# EAGLE design RFM69W (EAGLE 7.2.0)
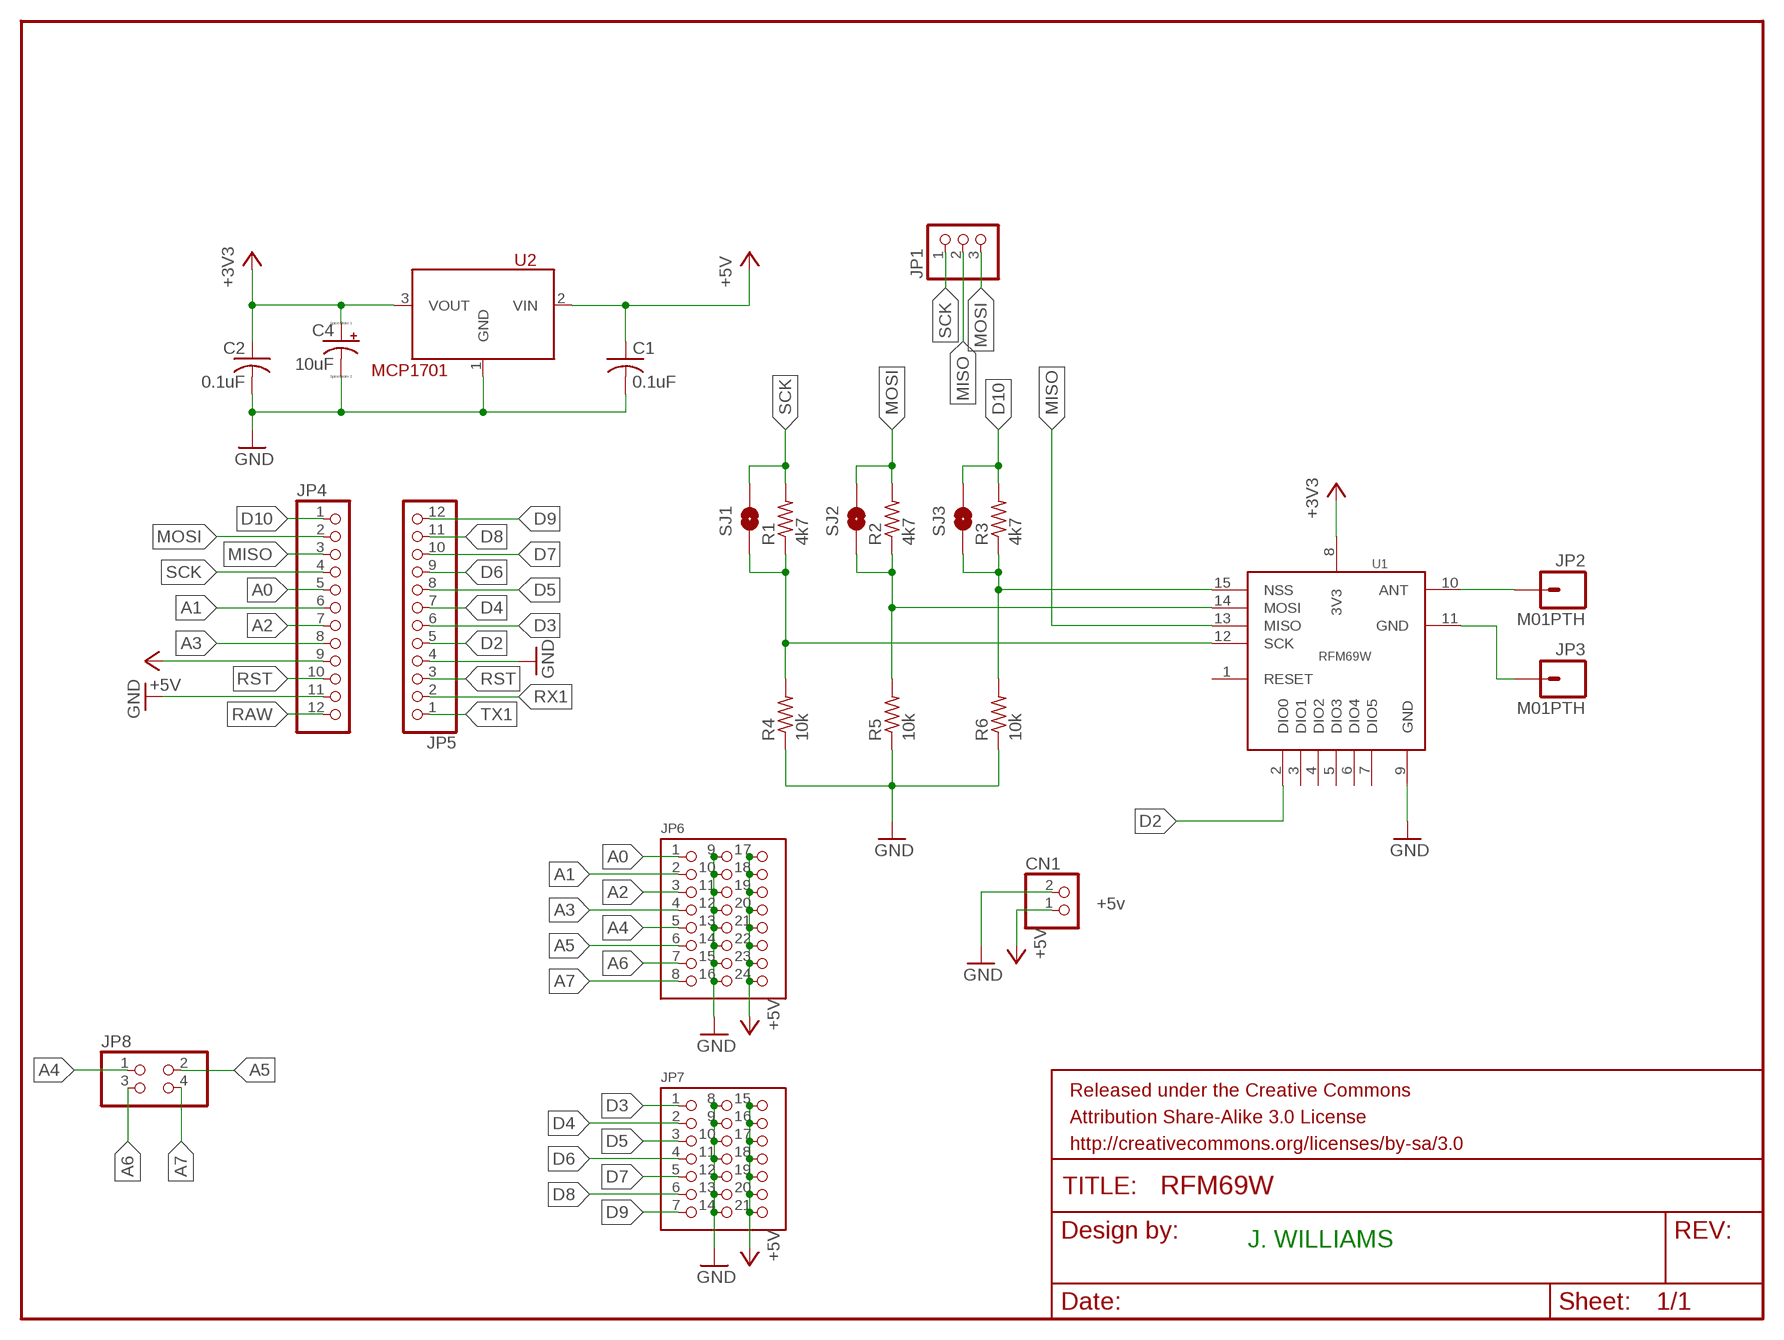
[diagram p0: schematic, sheet 1]

## Parts
C1  0.1uF  C-USC1206  [C1206]
C2  0.1uF  C-USC1206  [C1206]
C4  10uF  CPOL-USA/3216-18R  [A/3216-18R]
CN1  +5v  JST_2PIN-THM-RA  [JST-PH-2-THM-RA]
FRAME1  FRAME-LETTER  [CREATIVE_COMMONS]
JP1  PINHD-1X3  [1X03]
JP2  M01PTH  [1X01]
JP3  M01PTH  [1X01]
JP4  PINHD-1X12  [1X12]
JP5  PINHD-1X12  [1X12]
JP6  PIN_3X8  [PIN_3X8]
JP7  PIN_3X7  [PIN_3X7]
JP8  PINHD-2X2  [2X02]
R1  4k7  R-US_R1206  [R1206]
R2  4k7  R-US_R1206  [R1206]
R3  4k7  R-US_R1206  [R1206]
R4  10k  R-US_R1206  [R1206]
R5  10k  R-US_R1206  [R1206]
R6  10k  R-US_R1206  [R1206]
SJ1  SOLDERJUMPERNO  [SJ_2S-NO]
SJ2  SOLDERJUMPERNO  [SJ_2S-NO]
SJ3  SOLDERJUMPERNO  [SJ_2S-NO]
U1  RFM69W  [RFM69W]
U2  MCP1701  [SOT-89]

## Nets
+3V3: C2.1 C4.+ U1.8(3V3) U2.3(VOUT)
+5V: C1.1 CN1.1 JP4.9 JP6.17 JP6.18 JP6.19 JP6.20 JP6.21 JP6.22 JP6.23 JP6.24 JP7.15 JP7.16 JP7.17 JP7.18 JP7.19 JP7.20 JP7.21 U2.2(VIN)
A0: JP4.5 JP6.1
A1: JP4.6 JP6.2
A2: JP4.7 JP6.3
A3: JP4.8 JP6.4
A4: JP6.5 JP8.1
A5: JP6.6 JP8.2
A6: JP6.7 JP8.3
A7: JP6.8 JP8.4
D2: JP5.5 U1.2(DIO0)
D3: JP5.6 JP7.1
D4: JP5.7 JP7.2
D5: JP5.8 JP7.3
D6: JP5.9 JP7.4
D7: JP5.10 JP7.5
D8: JP5.11 JP7.6
D9: JP5.12 JP7.7
D10: JP4.1 R3.2 SJ3.2
GND: C1.2 C2.2 C4.- CN1.2 JP4.11 JP5.4 JP6.9 JP6.10 JP6.11 JP6.12 JP6.13 JP6.14 JP6.15 JP6.16 JP7.8 JP7.9 JP7.10 JP7.11 JP7.12 JP7.13 JP7.14 R4.1 R5.1 R6.1 U1.9(GND) U2.1(GND)
MISO: JP1.2 JP4.3 U1.13(MISO)
MOSI: JP1.3 JP4.2 R2.2 SJ2.2
N$1: R3.1 R6.2 SJ3.1 U1.15(NSS)
N$5: R2.1 R5.2 SJ2.1 U1.14(MOSI)
N$10: R1.1 R4.2 SJ1.1 U1.12(SCK)
N$11: JP2.1 U1.10(ANT)
N$12: JP3.1 U1.11(GND)
RAW: JP4.12
RST: JP4.10 JP5.3
RX1: JP5.2
SCK: JP1.1 JP4.4 R1.2 SJ1.2
TX1: JP5.1
Unconnected: U1.1(RESET) U1.3(DIO1) U1.4(DIO2) U1.5(DIO3) U1.6(DIO4) U1.7(DIO5)

## Notes on the sheet
- J. WILLIAMS

## Library data of the parts
C1 C2 = rcl:C-US: CAPACITOR, American symbol
C4 = resistor:CPOL-US: POLARIZED CAPACITOR, American symbol
CN1 = adafruit:JST_2PIN: JST 2-Pin Connectors of various flavors SMT-RA (S2B-PH-SM4) 4UConnector #17311 SMT (B2B-PH-SM4) THM-RA (S2B-PH) THM (B2B-PH)
FRAME1 = SparkFun-Aesthetics:FRAME-LETTER: Schematic Frame Standard 8.5x11 US Letter frame
JP1 = pinhead:PINHD-1X3: PIN HEADER
JP2 JP3 = SparkFun-Connectors:M01: Header 1 Standard 1-pin 0.1" header. Use with straight break away headers (SKU : PRT-00116), right angle break away headers (PRT-00553), swiss pins (PRT-00743), machine pins (PRT-00117), and female headers (PRT-00115).
JP4 JP5 = pinhead:PINHD-1X12: PIN HEADER
JP6 = pinhead_3row:PIN_3X8
JP7 = pinhead_3row:PIN_3X7
JP8 = pinhead:PINHD-2X2: PIN HEADER
R1-R6 = resistor:R-US_: RESISTOR, American symbol
SJ1-SJ3 = SparkFun-Passives:SOLDERJUMPER: Solder Jumper Standard SMD solder jumper. Used to automate production. Two varients : Normally Open and Normally Closed are the same, but have different paste layers. NC will have a large amount of paste and should jumper during reflow.
U1 = ChipsParts:RFM69W: Radio Transceiver Module, FSK, 433, 848, 915 MHz, SPI controlled, Mfr=HopeRF
U2 = ChipsParts:MCP1701: Voltage Regulator, LDO, fixed 1.8,2.5,3.0,3.3,5.0V, 500mW/Vdrop

## Board
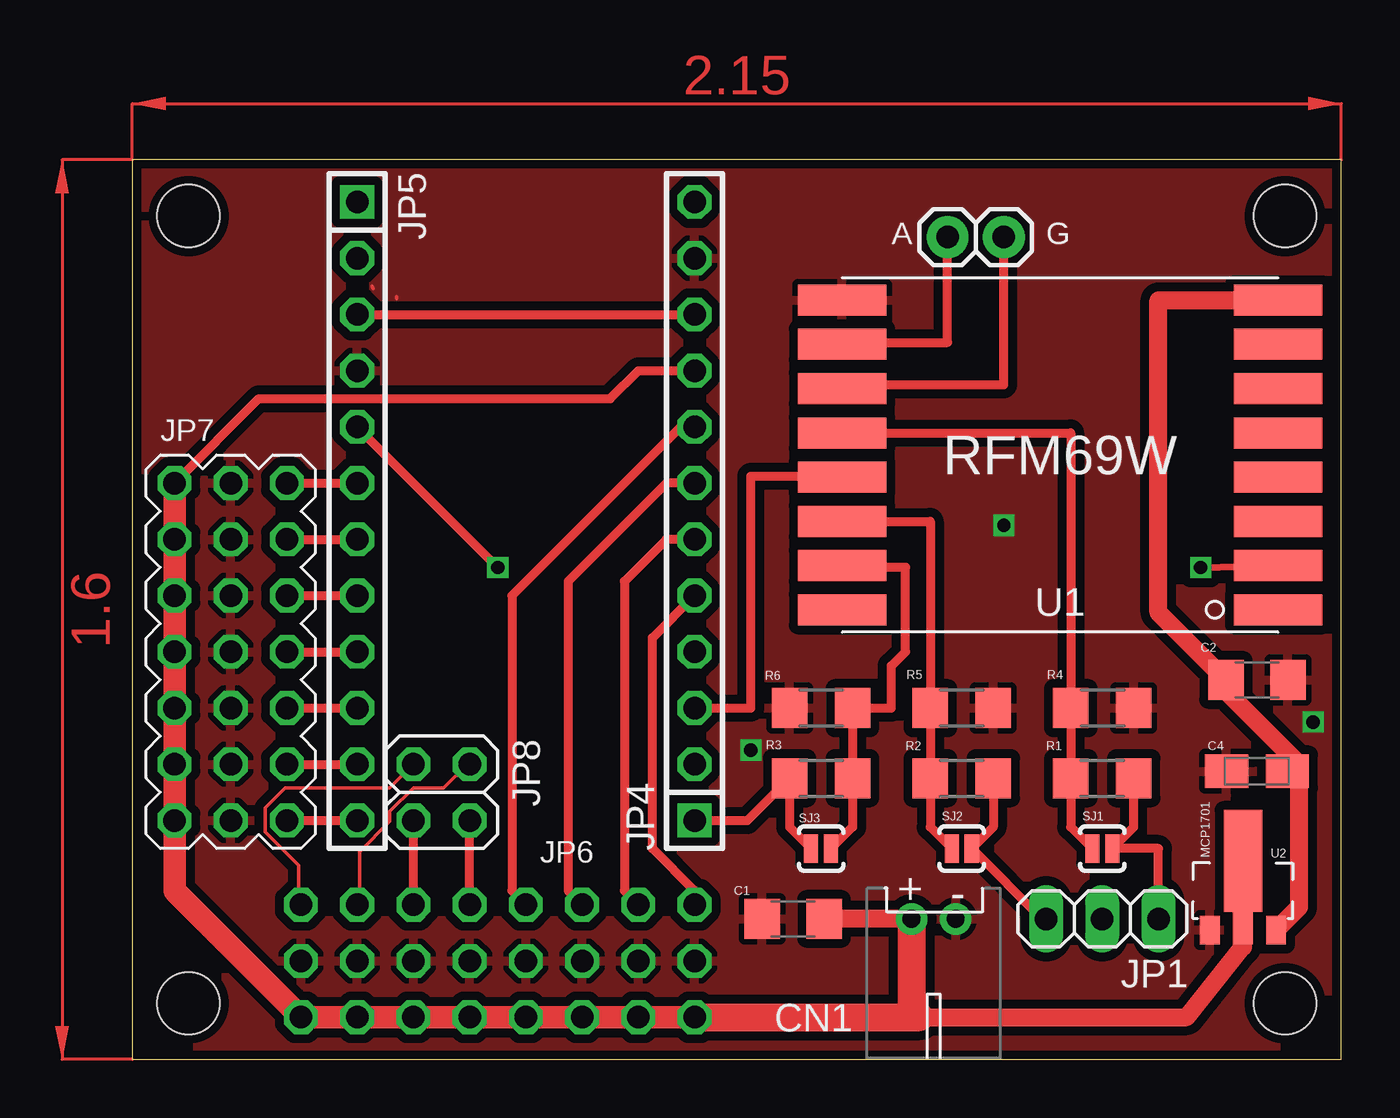
[diagram p1: board, top side]
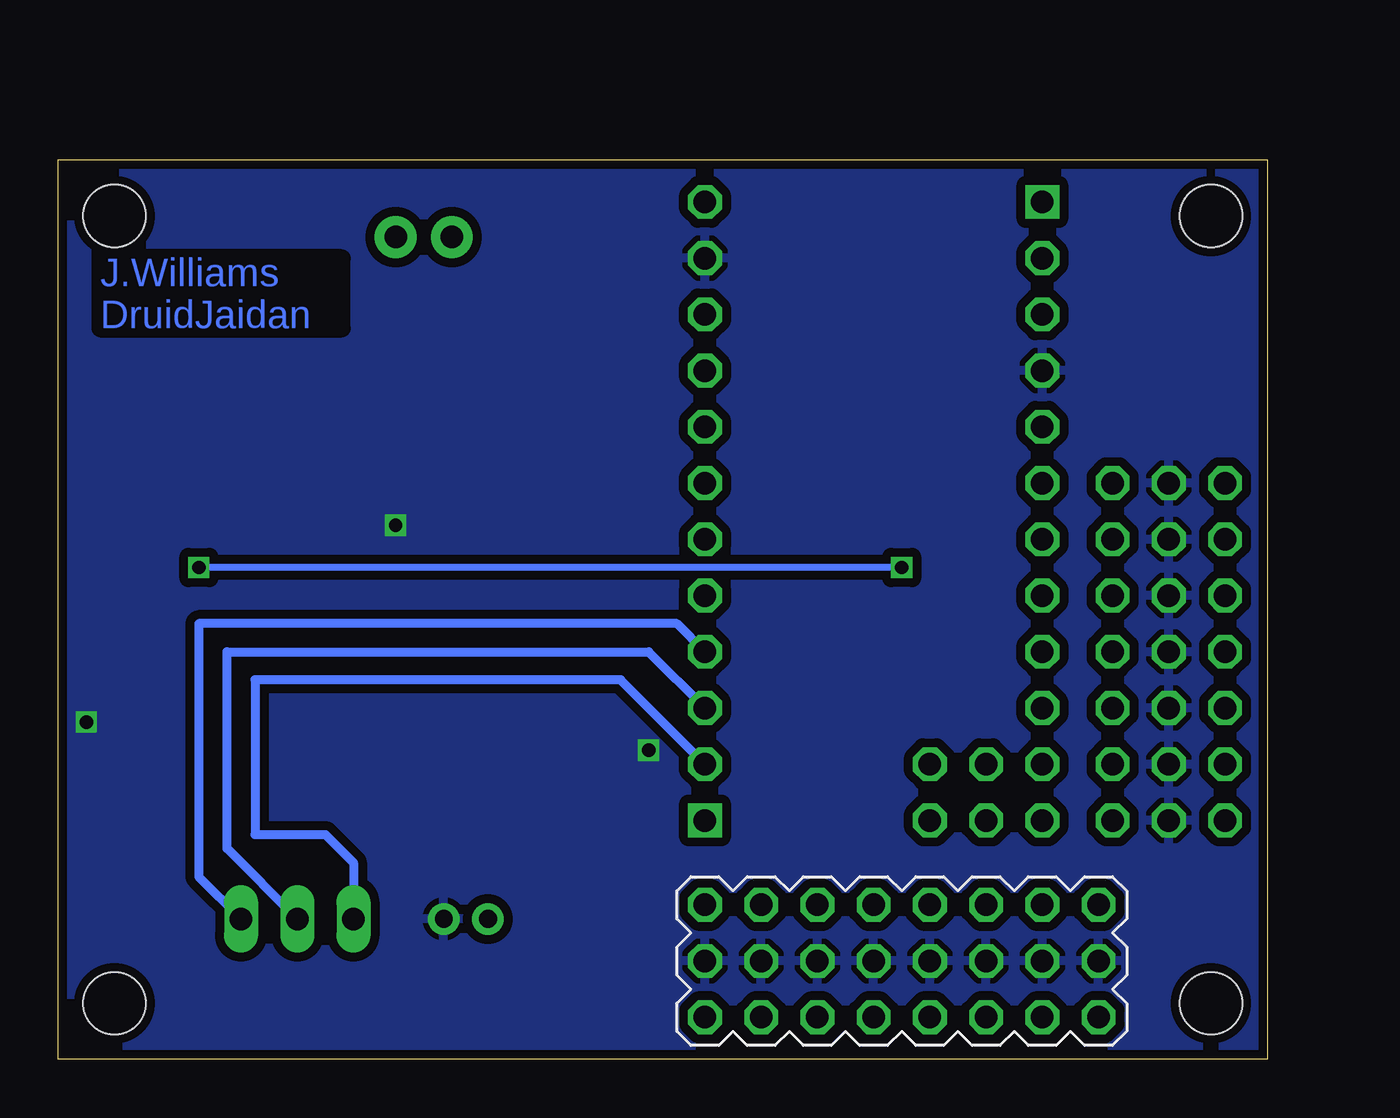
[diagram p2: board, bottom side, seen from below]

Size 54.61 x 40.64 mm. Coordinates in mm from the lower left corner, seen from the top.
Outline: 0,0 54.61,0 54.61,40.64 0,40.64 0,0
Copper layers (1*16): Top 0.0356mm / dielectric 1.5011mm / Bottom 0.0356mm
Design rules "LaenPCBOrder": minimum track width 6mil, minimum drill 13mil, track to track 6mil, track to pad 6mil, pad to pad 6mil, via to via 6mil, smd to smd 6mil, copper to edge 15mil, drill to drill 6mil, minimum pad ring 7mil, minimum via ring 7mil, stop-mask expansion 3mil, vias tented up to drill 0mil, thermal gap 10mil
Holes 2.8 mm at 52.07,38.1 52.07,2.54 2.54,2.54 2.54,38.1

### Footprints (pad centres in the part's own frame; a part is rotated, then mirrored left to right if it is on the bottom)
C1206 = smd 1.6 x 1.8: 1 -1.4,0; 2 1.4,0
A/3216-18R = smd 1.95 x 1.5: + 1.375,0; - -1.375,0
JST-PH-2-THM-RA = drill 0.8 pad 1.422: 1 1,0; 2 -1,0
1X03 = drill 1.016 long: 1 -2.54,0; 2 0,0; 3 2.54,0
1X01 = drill 1.016 pad 1.88: 1 0,0
1X12 = drill 1.016 square: 1 -13.97,0 | drill 1.016 octagon: 2 -11.43,0; 3 -8.89,0; 4 -6.35,0; 5 -3.81,0; 6 -1.27,0; 7 1.27,0; 8 3.81,0; 9 6.35,0; 10 8.89,0; 11 11.43,0; 12 13.97,0
PIN_3X8 = drill 1.016 octagon: 1 1.27,-1.27; 2 3.81,-1.27; 3 6.35,-1.27; 4 8.89,-1.27; 5 11.43,-1.27; 6 13.97,-1.27; 7 16.51,-1.27; 8 19.05,-1.27; 9 1.27,-3.81; 10 3.81,-3.81; 11 6.35,-3.81; 12 8.89,-3.81; 13 11.43,-3.81; 14 13.97,-3.81; 15 16.51,-3.81; 16 19.05,-3.81; 17 1.27,-6.35; 18 3.81,-6.35; 19 6.35,-6.35; 20 8.89,-6.35; 21 11.43,-6.35; 22 13.97,-6.35; 23 16.51,-6.35; 24 19.05,-6.35
PIN_3X7 = drill 1.016 octagon: 1 1.27,-1.27; 2 3.81,-1.27; 3 6.35,-1.27; 4 8.89,-1.27; 5 11.43,-1.27; 6 13.97,-1.27; 7 16.51,-1.27; 8 1.27,-3.81; 9 3.81,-3.81; 10 6.35,-3.81; 11 8.89,-3.81; 12 11.43,-3.81; 13 13.97,-3.81; 14 16.51,-3.81; 15 1.27,-6.35; 16 3.81,-6.35; 17 6.35,-6.35; 18 8.89,-6.35; 19 11.43,-6.35; 20 13.97,-6.35; 21 16.51,-6.35
2X02 = drill 1.016 octagon: 1 -1.27,-1.27; 2 -1.27,1.27; 3 1.27,-1.27; 4 1.27,1.27
R1206 = smd 1.6 x 1.803: 1 -1.422,0; 2 1.422,0
SJ_2S-NO = smd 0.635 x 1.27: 1 -0.45,0; 2 0.45,0
RFM69W = smd 4 x 1.4: 1 -9.85,7; 2 -9.85,5; 3 -9.85,3; 4 -9.85,1; 5 -9.85,-1; 6 -9.85,-3; 7 -9.85,-5; 8 -9.85,-7; 9 9.85,-7; 10 9.85,-5; 11 9.85,-3; 12 9.85,-1; 13 9.85,1; 14 9.85,3; 15 9.85,5; 16 9.85,7
SOT-89 = smd 0.9 x 1.3: 1 -1.5,-1.775; 3 1.5,-1.775 | smd 0.9 x 1.475: 2 0,-1.688 | smd 1.733 x 4.6: P$4 0,1.35

### Placement (x,y rotation side)
C1  29.85,6.35 180 top
C2  50.8,17.14 0 top
C4  50.8,13.02 0 top
CN1  36.19,6.35 180 top
FRAME1  11.43,-15.88 0 top  (outside the outline)
JP1  43.81,6.35 180 top
JP2  36.83,37.15 0 top
JP3  39.37,37.15 0 top
JP4  25.4,24.77 90 top
JP5  10.16,24.77 270 top
JP6  26.67,8.26 0 bottom
JP7  8.25,27.3 270 top
JP8  13.97,12.07 90 top
R1  43.81,12.7 0 top
R2  37.47,12.7 0 top
R3  31.11,12.7 180 top
R4  43.81,15.88 180 top
R5  37.47,15.88 180 top
R6  31.11,15.88 0 top
SJ1  43.81,9.53 0 top
SJ2  37.47,9.53 0 top
SJ3  31.11,9.53 180 top
U1  41.91,27.3 180 top
U2  50.17,7.62 0 top

### Tracks (layer width: path | path; a pad name or v marks a point on that pad's centre or on a via)
+3V3
  Top 0.152: U1.8 51.71,34.37 51.11,34.37 50.8,34.29
  Top 0.406: 52.7,13.34 52.39,13.02 C4.+
  Top 0.813: U2.3 52.7,6.88 52.7,13.34 49.4,16.64 C2.1 46.36,20.19 46.36,34.29 50.8,34.29
+5V
  Top 0.152: 2.03,13.34 JP7.20 | JP7.19 2.03,15.93 1.9,15.93 | JP7.18 2.03,18.52 1.9,18.52 | 2.03,20.95 JP7.17 | JP7.16 2.03,23.55 1.9,23.55 | 35.19,2.51 35.25,2.51 35.25,1.91
  Top 0.406: U2.2 50.17,5.08 | JP7.15 5.71,29.84 21.59,29.84 22.86,31.12 JP4.9
  Top 0.813: 35.56,1.91 47.62,1.91 50.17,5.08 | CN1.1 C1.1
  Top 1.016: JP7.15 1.9,23.55 JP7.16 JP7.17 1.9,18.52 JP7.18 1.9,15.93 JP7.19 JP7.20 JP7.21 1.9,7.62 JP6.24 JP6.23 JP6.22 JP6.21 JP6.20 JP6.19 JP6.18 JP6.17
  Top 1.27: CN1.1 35.19,2.51 35.19,1.91 | JP6.17 35.25,1.91 35.56,1.91
A0
  Top 0.406: JP6.1 25.4,7.62 23.5,9.53 23.5,19.05 JP4.5
A1
  Top 0.406: JP4.6 24.13,23.49 22.22,21.59 22.22,7.62 JP6.2
A2
  Top 0.406: JP4.7 24.13,26.04 19.68,21.59 19.68,7.62 JP6.3
A3
  Top 0.406: JP4.8 24.76,28.57 17.14,20.95 17.14,7.62 JP6.4
A4
  Top 0.406: JP6.5 JP8.1
A5
  Top 0.406: JP6.6 JP8.2
A6
  Top 0.152: JP6.7 10.26,7.09 10.26,9.37 11.63,10.74 11.63,11.2 12.7,12.27 14.07,12.27 15.14,13.34 JP8.3
A7
  Top 0.152: JP8.4 11.63,12.27 6.91,12.27 5.99,11.35 5.99,10.29 7.52,8.76 7.52,7.09 JP6.8
D2  (via drill 0.6)
  Top 0.254: 51.76,22.22 U1.2
  Top 0.305: v48.26,22.22 U1.2
  Top 0.406: v16.51,22.22 JP5.5
  Bottom 0.305: v16.51,22.22 v48.26,22.22
D3
  Top 0.406: JP7.1 JP5.6
D4
  Top 0.406: JP7.2 JP5.7
D5
  Top 0.406: JP7.3 JP5.8
D6
  Top 0.406: JP7.4 JP5.9
D7
  Top 0.406: JP7.5 JP5.10
D8
  Top 0.406: JP7.6 JP5.11
D9
  Top 0.406: JP7.7 JP5.12
D10
  Top 0.406: JP4.1 27.79,10.79 R3.2 29.69,10.5 SJ3.2
GND  (via drill 0.6)
  Top 0.152: 11.94,34.37 11.94,34.47 | 10.87,34.82 10.83,34.92
  other vias: 53.34,15.24 39.37,24.13 27.94,13.97
  pour Bottom (isolate 0.406): 0,0 0,40.64 54.61,40.64 54.61,0
  pour Top (isolate 0.406): 0,0 0,40.64 54.61,40.64 54.61,0
MISO
  Top 0.406: JP4.3 27.94,15.88 27.94,26.35 32.06,26.35 U1.13
  Bottom 0.406: JP1.2 46.99,9.53 46.99,18.41 27.94,18.41 JP4.3
MOSI
  Top 0.406: JP1.3 41.09,6.35 SJ2.2 38.89,10.5 R2.2
  Bottom 0.406: JP4.2 29.21,17.14 45.72,17.14 45.72,10.16 42.55,10.16 41.28,8.89 JP1.3
N$1
  Top 0.406: SJ3.1 32.54,10.5 R3.1 R6.2 34.29,15.88 34.29,17.78 34.92,18.41 34.92,22.22 32.14,22.22 U1.15
N$5
  Top 0.406: U1.14 36.04,24.3 R5.2 R2.1 36.04,10.5 SJ2.1
N$10
  Top 0.406: U1.12 42.39,28.3 R4.2 R1.1 42.39,10.5 SJ1.1
N$11
  Top 0.254: 30.87,32.38 U1.10
  Top 0.406: U1.10 32.14,32.38 36.83,32.38 JP2.1
N$12
  Top 0.406: U1.11 32.23,30.48 39.37,30.48 JP3.1
RST
  Top 0.406: JP5.3 JP4.10
SCK
  Top 0.406: JP1.1 46.36,9.53 SJ1.2 45.24,10.5 R1.2
  Bottom 0.406: JP4.4 26.67,19.68 48.26,19.68 48.26,8.26 JP1.1
(copper drawn outside any net)
  shapes: Top area x2

### Text on the board
Bottom: J.Williams / DruidJaidan
tPlace: A | G